# Altium schematic sheet Power Selection - AUX.SchDoc: Title
size B; Organization: Midnight Sun Solar Rayce Car Team; Address1: University of Waterloo; Address2: 200 University Ave W; Address3: Waterloo, ON, Canada; Address4: N2L 3E9; Website: www.uwmidsun.com; ProjectName: ProjectName
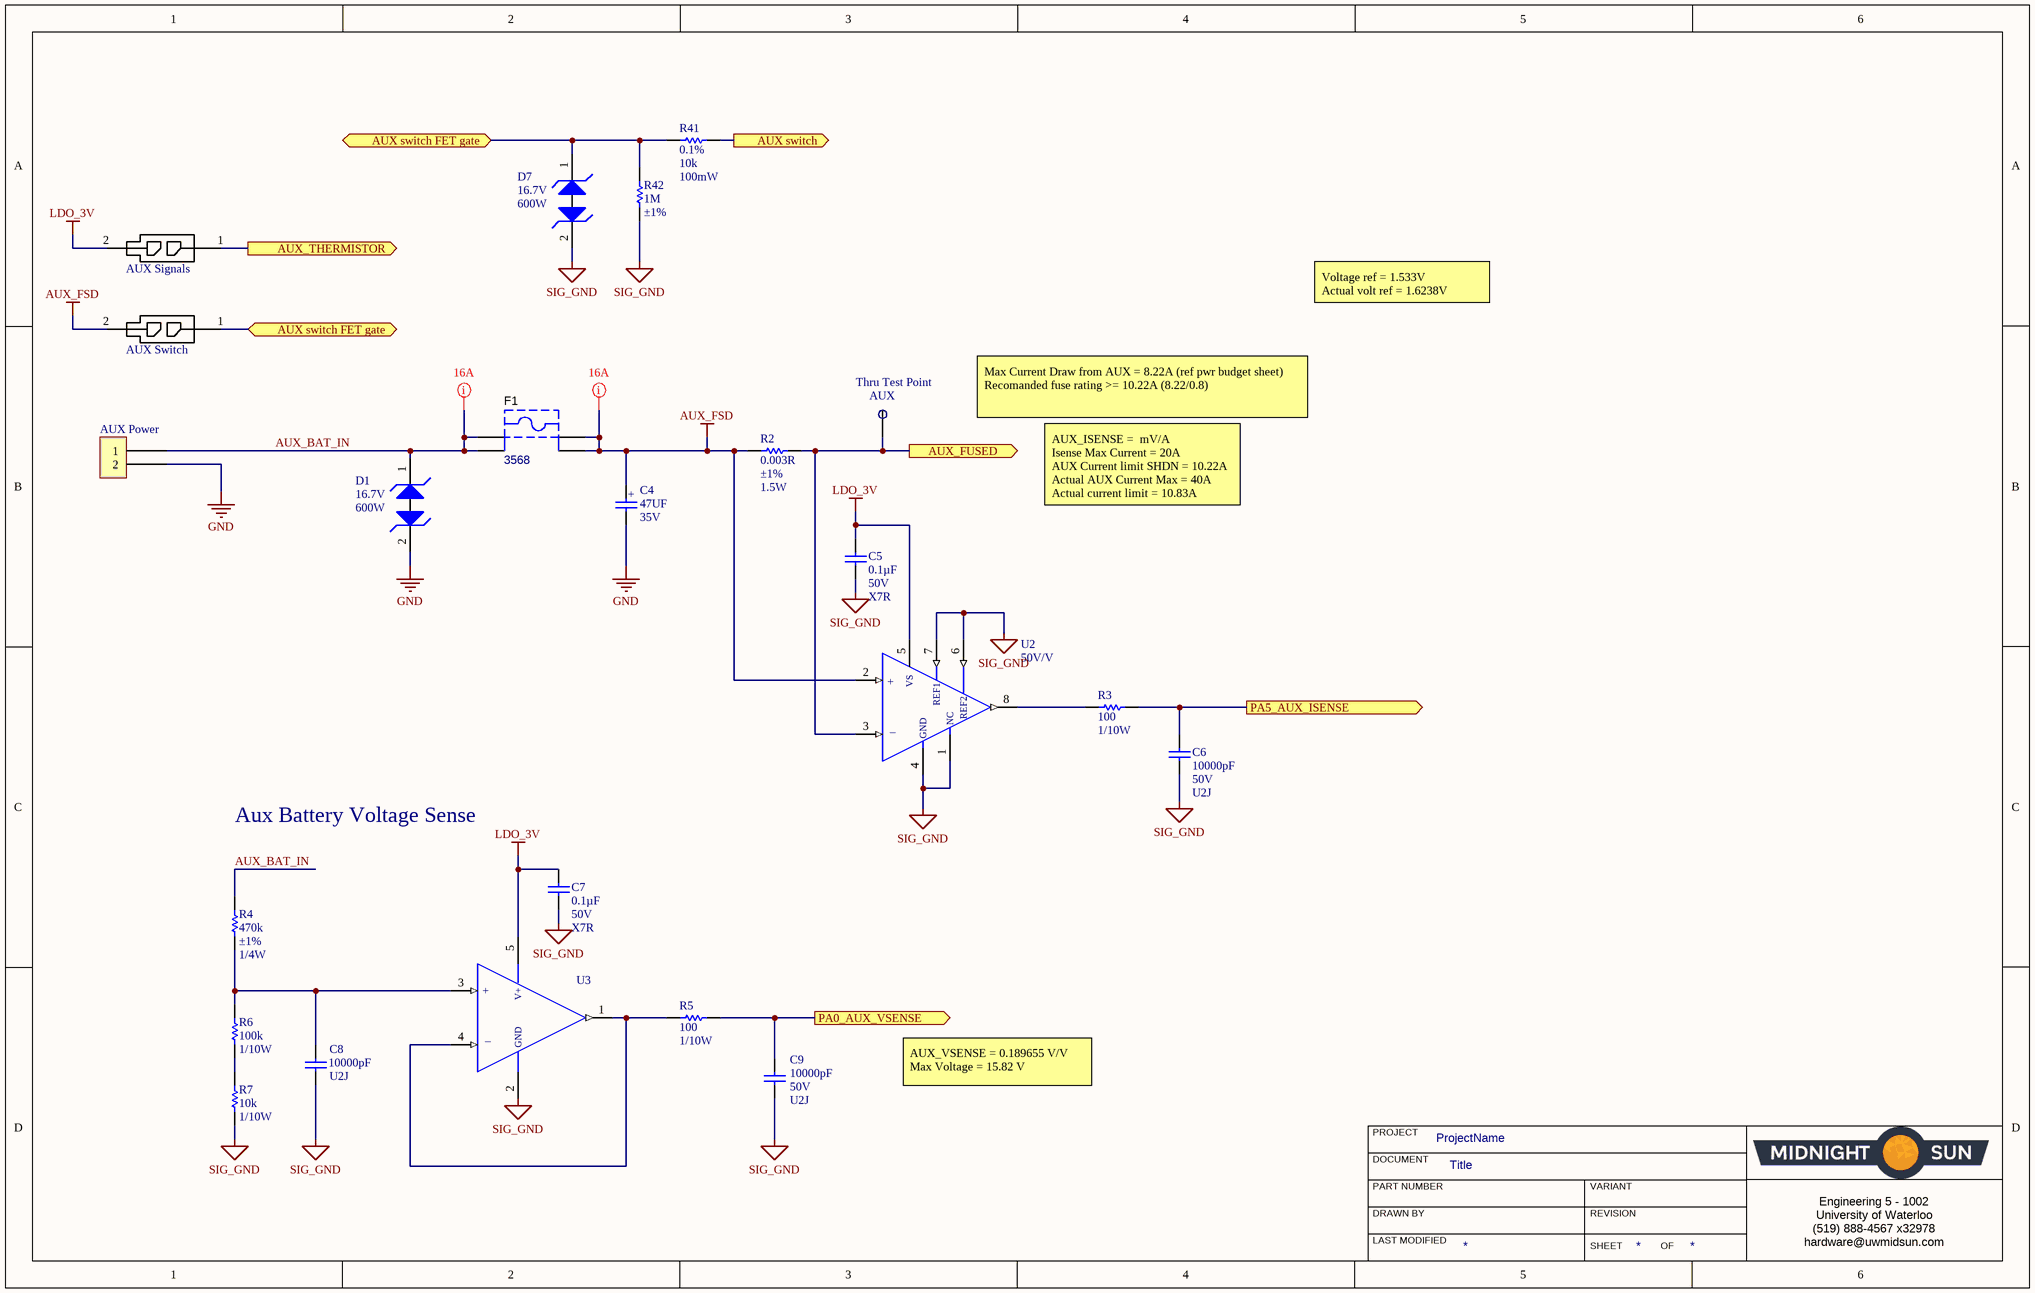
[diagram p0: Power Selection - AUX.SchDoc]

## Parts
AUX  Thru Test Point  [Thru Test Point]
AUX_Power  CONN HEADER TE  ELCON Mini 2POS PCB  [CONN HEADER TE  ELCON Mini 2POS PCB-Footprint-1]  (value not drawn)
AUX_Signals  CONN 2POS MICRO-FIT 3mm  [CONN, 2POS MICRO-FIT]  (value not drawn)
AUX_Switch  CONN 2POS MICRO-FIT 3mm  [CONN, 2POS MICRO-FIT]  (value not drawn)
C4  47UF  Voltage Rating: 35V  [CAP ALUM 6.3MM RADIAL SMD]
C5  Capacitance: 0.1µF  Voltage: 50V  Temperature Coefficient: X7R  [CAP, 0603]  (hidden comment: CAP CER 0.1UF 50V 10% X7R 0603)
C6  Capacitance: 10000pF  Voltage: 50V  Temperature Coefficient: U2J  [CAP, 0603]  (hidden comment: CAP CER 10nF 50V 5% X7R 0603)
C7  Capacitance: 0.1µF  Voltage: 50V  Temperature Coefficient: X7R  [CAP, 0603]  (hidden comment: CAP CER 0.1UF 50V 10% X7R 0603)
C8  Capacitance: 10000pF  Temperature Coefficient: U2J  [CAP, 0603]  (hidden comment: CAP CER 10nF 50V 5% X7R 0603)
C9  Capacitance: 10000pF  Voltage: 50V  Temperature Coefficient: U2J  [CAP, 0603]  (hidden comment: CAP CER 10nF 50V 5% X7R 0603)
D1  Voltage - Breakdown (Min): 16.7V  Power - Peak Pulse: 600W  [DO-214AA Diode]  (hidden comment: DIODE TVS 15VWM 24.4VC DO-214AA (SMB))
D7  Voltage - Breakdown (Min): 16.7V  Power - Peak Pulse: 600W  [DO-214AA Diode]  (hidden comment: DIODE TVS 15VWM 24.4VC DO-214AA (SMB))
F1  3568  [KSTN-3568_V]
R2  Resistance (Ohms): 0.003R  Tolerance: ±1%  Power (Watts): 1.5W  [RES 2010]  (hidden comment: RES 0.003 OHM 1% 1.5W 2010)
R3  Resistance: 100  Power: 1/10W  [RES, 0603]  (hidden comment: RES 100 OHM 1% 1/10W 0603)
R4  Resistance: 470k  Tolerance: ±1%  Power: 1/4W  [RES, 0603]  (hidden comment: RES 470K OHM 1% 1/4W 0603)
R5  Resistance: 100  Power: 1/10W  [RES, 0603]  (hidden comment: RES 100 OHM 1% 1/10W 0603)
R6  Resistance: 100k  Power: 1/10W  [RES, 0603]  (hidden comment: RES 100K OHM 5% 1/8W 0603)
R7  Resistance: 10k  Power: 1/10W  [RES, 0603]  (hidden comment: RES 10K OHM 1% 1/10W 0603)
R41  value 10k  Tolerance: 0.1%  Max Power Dissipation: 100mW  [RES, 0603]  (hidden comment: RES SMD 1K OHM 0.1% 1/10W 0603)
R42  Resistance (Ohms): 1M  Tolerance: ±1%  [RES, 0603]  (hidden comment: RES 1M OHM 1% 1/10W 0603)
U2  50V/V  [IC CURRENT AMPLIFIER INA240 TSSOP-8]
U3  IC OP AMP GEN PURPOSE RR 10MHZ SOT-23-5  [IC OP AMP GP RR 10MHZ SOT-23-5]  (value not drawn)

## Ports
AUX switch (out), AUX switch FET gate (bidir), AUX_FUSED (out), AUX_THERMISTOR (out), PA0_AUX_VSENSE (out), PA5_AUX_ISENSE (out)

## Nets
AUX_FSD: AUX_Switch.2 C4.1 F1.3 F1.4 R2.1 U2.2(+IN)
GND: AUX_Power.2 C4.2 D1.2(Cathode2)
LDO_3V: AUX_Signals.2 C5.1 C7.1 U2.5(VS) U3.5(VDD)
SIG_GND: C5.2 C6.2 C7.2 C8.2 C9.2 D7.2(Cathode2) R7.2 R42.2 U2.1(NC) U2.4(GND) U2.6(REF2) U2.7(REF1) U3.2(VSS)
AUX switch: R41.2 ; port AUX switch
AUX switch FET gate: AUX_Switch.1 D7.1(Cathode1) R41.1 R42.1 ; port AUX switch FET gate
AUX_BAT_IN: AUX_Power.1 D1.1(Cathode1) F1.1 F1.2 R4.1
AUX_FUSED: AUX.TH_TP R2.2 U2.3(-IN) ; port AUX_FUSED
AUX_THERMISTOR: AUX_Signals.1 ; port AUX_THERMISTOR
PA0_AUX_VSENSE: C9.1 R5.2 ; port PA0_AUX_VSENSE
PA5_AUX_ISENSE: C6.1 R3.2 ; port PA5_AUX_ISENSE
NetC8_1: C8.1 R4.2 R6.1 U3.3(+IN)
NetR3_1: R3.1 U2.8(OUTPUT)
NetR5_1: R5.1 U3.1(OUTPUT) U3.4(-IN)
NetR6_2: R6.2 R7.1

## Layout directives
net class HighCurrent; rule Power Plane Connect Style [Style - Direct Connect]; rule Polygon Connect Style [Style - Direct Connect]: AUX_BAT_IN, AUX_FSD

## Notes on the sheet
- Voltage ref = 1.533V
  Actual volt ref = 1.6238V
- Max Current Draw from AUX = 8.22A (ref pwr budget sheet)
  Recomanded fuse rating >= 10.22A (8.22/0.8)
- AUX_ISENSE =  mV/A
  Isense Max Current = 20A
  AUX Current limit SHDN = 10.22A
  Actual AUX Current Max = 40A
  Actual current limit = 10.83A
- Aux Battery Voltage Sense
- AUX_VSENSE = 0.189655 V/V
  Max Voltage = 15.82 V
- PROJECT
- DOCUMENT
- DRAWN BY
- LAST MODIFIED
- PART NUMBER
- REVISION
- SHEET
- VARIANT
- OF
- Engineering 5 - 1002
  University of Waterloo
  (519) 888-4567 x32978
  hardware@uwmidsun.com
- (in symbol CAP ALUM 47UF 20% 35V SMD) +
- (in symbol IC CURRENT AMPLIFIER INA240 8-TSSOP) +; _
- (in symbol IC OP AMP GEN PURPOSE RR 10MHZ SOT-23-5) V+; +; GND; _

## Library data of the parts
AUX_Power = CMP-002-00071-4: CONN HEADER 2POS PCB; Contact Current Rating: 40A; Number of Contacts: 2; Pitch: 7.8mm; Contact Retention: Yes (With); Sealable: No (Without); Current Rating: 45A; Circuit Application: Power; Gender: Male; Connector Type: Pin; PCB Mounting Orientation: Vertical; Number of Ports: 1; Connector System: Wire-to-Board; Number of Rows: 1; Contact Plating: Silver; Housing Color: Black; Length: 18.9mm; Package Quantity: 150; Number of Terminals: 4; Orientation: Straight; REACH SVHC: Unknown; Contact Material: Copper Alloy,Copper; Housing Material: Polymer; Depth: 10.2mm; Row Spacing: 7.8mm; Termination: Through Hole; Min Operating Temperature: -40°C; Number of Positions: 2; Contact Gender: Male; Packaging: Tape and Reel; Mount: Through Hole; Number of Power Positions: 2; Radiation Hardening: No; Flammability Rating: UL94 V-0; Max Operating Temperature: 125°C
AUX_Signals AUX_Switch = CONN 2POS MICRO-FIT 3mm: Connector Header Through Hole 2 position; Manufacturer: Molex; Manufacturer Part Number: 43045-0227; Number of Positions: 2; Gender: Male; Contact Resistance: 10mR; Number of Ports: 1; Max Voltage Rating (DC): 250.25kV; Current Rating: 5A; Voltage Rating: 600V; Glow Wire Compliant: Compliant; Supplier 1: Digi-Key; Stock 1: 3657; Pricing 1: 1=0.84, 10=0.74, 25=0.6968, 50=0.6676, 100=0.6387, 250=0.5806, 500=0.52254, 1000=0.46448, 2500=0.42094 (USD); Mount: Through Hole; Contact Plating: Tin; Contact Material: Brass; Housing Colour: Black; Housing Material: Thermoplastic; Number of Terminals: 2; Min Operating Temperature: -40°C; Max Operating Temperature: 105°C; Number of Rows: 2; Packaging: Tray; Termination: Solder; Number of Contacts: 2; Orientation: Vertical; Package Quantity: 3168; Number of Circuits: 2; Length: 7.15mm; Pitch: 3mm; Depth: 8.77mm; Row Spacing: 3mm; Radiation Hardening: No; Halogen Free: Low Halogen; ComponentLink1URL: http://www.onlinecomponents.com/productFiles/mf-MOL/307170430450227_pcb_headers.pdf; ComponentLink1Description: http://www.onlinecomponents.com/productFiles/mf-MOL/307170430450227_pcb_headers.pdf; ComponentLink2URL: http://www.mouser.com/ds/2/276/0430450227_PCB_HEADERS-142611.pdf; ComponentLink2Description: http://www.mouser.com/ds/2/276/0430450227_PCB_HEADERS-142611.pdf; ComponentLink3URL: http://uk.rs-online.com/webdocs/13c3/0900766b813c3a46.pdf; ComponentLink3Description: http://uk.rs-online.com/webdocs/13c3/0900766b813c3a46.pdf; ComponentLink4URL: http://www.molex.com/webdocs/datasheets/pdf/en-us/0430450227_PCB_HEADERS.pdf; ComponentLink4Description: http://www.molex.com/webdocs/datasheets/pdf/en-us/0430450227_PCB_HEADERS.pdf; Supplier Part Number 1: WM10657-ND
C4 = CAP ALUM 47UF 20% 35V SMD: 47µF 35V Aluminum Electrolytic Capacitors Radial, Can - SMD 1000 Hrs @ 85°C; Manufacturer: Panasonic; Manufacturer Part Number: EEE-1VA470WP; Tolerance: 20%; Ripple Current: 70mA; Life (Hours): 1000Hour; Supplier 1: Digi-Key; Stock 1: 2820; Pricing 1: 1=0.38, 10=0.263, 100=0.1579, 500=0.11846 (USD); Mount: Surface Mount,PCB; Case/Package: Radial; Contact Plating: Tin; Min Operating Temperature: -40°C; Max Operating Temperature: 85°C; Capacitance: 47uF; Voltage Rating (DC): 35V; Packaging: Tape and Reel; Package Quantity: 1; Ripple Current (AC): 70mA; Termination: SMD/SMT; Diameter: 6.3mm; Length: 5.5mm; Height: 5.4mm; Height - Seated (Max): 0.213inch; Radiation Hardening: No; REACH SVHC: Unknown; Lead Free: Lead Free; ComponentLink1URL: https://datasheet.ciiva.com/2983/aba0000ce2-2983926.pdf; ComponentLink1Description: https://datasheet.ciiva.com/2983/aba0000ce2-2983926.pdf; ComponentLink2URL: https://datasheet.ciiva.com/2983/aba0000ce2-2983927.pdf; ComponentLink2Description: https://datasheet.ciiva.com/2983/aba0000ce2-2983927.pdf; ComponentLink3URL: https://datasheet.ciiva.com/14598/70255710-14598937.pdf; ComponentLink3Description: https://datasheet.ciiva.com/14598/70255710-14598937.pdf; ComponentLink4URL: https://datasheet.ciiva.com/15165/getdatasheetpartid-86239-15165868.pdf; ComponentLink4Description: https://datasheet.ciiva.com/15165/getdatasheetpartid-86239-15165868.pdf; ComponentLink5URL: https://datasheet.ciiva.com/16507/aba0000ce2-16507965.pdf; ComponentLink5Description: https://datasheet.ciiva.com/16507/aba0000ce2-16507965.pdf; ComponentLink6URL: https://datasheet.ciiva.com/30206/11aba0000ce2-30206253.pdf; ComponentLink6Description: https://datasheet.ciiva.com/30206/11aba0000ce2-30206253.pdf; Supplier Part Number 1: PCE3961CT-ND
C5 C7 = CAP CER 0.1UF 50V 10% X7R 0603: 0.10µF ±10% 50V Ceramic Capacitor X7R 0603 (1608 Metric); Manufacturer 1: AVX Corporation; Manufacturer Part Number 1: 06035C104KAT2A; Supplier 1: Digi-Key; Supplier Part Number 1: 478-5052-1-ND; Packaging: Cut Tape (CT); Part Status: Active; Operating Temperature: -55°C ~ 125°C; Ratings: -; Mounting Type: Surface Mount, MLCC; Package / Case: 0603 (1608 Metric); Size / Dimension: 0.063" L x 0.032" W (1.60mm x 0.81mm); Height - Seated (Max): -; Thickness (Max): 0.035" (0.90mm); Lead Spacing: -; Lead Style: -; ComponentLink1URL: http://datasheets.avx.com/X7RDielectric.pdf; ComponentLink1Description: http://datasheets.avx.com/X7RDielectric.pdf; Tolerance: ±10%
C6 C8 C9 = CAP CER 10nF 50V 5% X7R 0603: 10000pF ±5% 50V Ceramic Capacitor U2J 0603 (1608 Metric); Manufacturer 1: KEMET; Manufacturer Part Number 1: C0603C103J5JAC7867; Supplier 1: Digi-Key; Supplier Part Number 1: 399-13384-1-ND; Packaging: Cut Tape (CT); Part Status: Active; Operating Temperature: -55°C ~ 125°C; Ratings: -; Failure Rate: -; Mounting Type: Surface Mount, MLCC; Package / Case: 0603 (1608 Metric); Size / Dimension: 0.063" L x 0.032" W (1.60mm x 0.80mm); Height - Seated (Max): -; Thickness (Max): 0.034" (0.87mm); Lead Spacing: -; Lead Style: -; ComponentLink1URL: http://www.kemet.com/docfinder?Partnumber=C0603C103J5JAC7867; ComponentLink1Description: http://www.kemet.com/docfinder?Partnumber=C0603C103J5JAC7867; Tolerance: ±5%
  C8: Voltage: 50V
D1 D7 = DIODE TVS 15VWM 24.4VC DO-214AA (SMB): TVS DIODE 15VWM 24.4VC SMB; Manufacturer 1: Fairchild/ON Semiconductor; Manufacturer Part Number 1: SMBJ15CA; Type: Zener; Voltage - Reverse Standoff (Typ): 15V; Voltage - Clamping (Max) @ Ipp: 24.4V; Current - Peak Pulse (10/1000µs): 24.6A; Power Line Protection: No; Supplier 1: Digi-Key; Supplier Part Number 1: SMBJ15CAFSCT-ND; RoHS: RoHS Compliant; Description 1: TVS DIODE 15VWM 24.4VC SMB; Category: Circuit Protection; Stock 1: 24965; Pricing 1: 1=0.54, 10=0.444, 100=0.3027, 500=0.22704, 1000=0.17028 (CAD); Packaging: Cut Tape (CT); Part Status: Active; Applications: General Purpose; Capacitance @ Frequency: -; Operating Temperature: -55°C ~ 150°C (TJ); Mounting Type: Surface Mount; Package / Case: DO-214AA, SMB; Supplier Device Package: DO-214AA (SMB); ComponentLink1URL: https://www.fairchildsemi.com/datasheets/SM/SMBJ10CA.pdf; ComponentLink1Description: https://www.fairchildsemi.com/datasheets/SM/SMBJ10CA.pdf
F1 = CMP-005-00014-1: Fuse Holder 20A 500VAC Pin Through Hole; Illumination Type: Illuminated; Number of Poles: 1; Voltage: 500V; Color: Black; Approvals: UL; Fuse Type: Automotive; Body Material: Nylon; Material: Brass,Tin,Nylon; Fuse Current: 20A; REACH SVHC: No SVHC; Depth: 6.73mm; Current Rating: 20A; Length: 16mm; Flammability Rating: UL94 V-0; Mount: PCB,Vertical; Voltage Rating (AC): 500V; Contact Plating: Tin; Max Operating Temperature: 145°C; Min Operating Temperature: -50°C; Lead Free: Lead Free; Package Quantity: 1; Number of Circuits: 1; Termination: PC Pin; Orientation: Vertical; Contact Material: Brass,Tin
R2 = RES 0.003 OHM 1% 1.5W 2010: 0.003 Ohm ±1% 1.5W Chip Resistor 2010 (5025 Metric) Current Sense, Moisture Resistant Metal Foil; Manufacturer 1: Stackpole Electronics Inc.; Manufacturer Part Number 1: CSNL2010FT3L00; Description 1: RES SMD 0.003 OHM 1% 1.5W 2010; Temperature Coefficient: ±50ppm/°C; Supplier 1: Digi-Key; Supplier Part Number 1: CSNL2010FT3L00CT-ND; RoHS: RoHS Compliant; Category: Resistors; Stock 1: 18532; Pricing 1: 1=1.02, 10=0.844, 25=0.7232, 50=0.6508, 100=0.5665, 250=0.5062, 500=0.4098, 1000=0.33145 (CAD); Packaging: Cut Tape (CT); Part Status: Active; Composition: Metal Foil; Features: Current Sense, Moisture Resistant; Operating Temperature: -55°C ~ 170°C; Package / Case: 2010 (5025 Metric); Supplier Device Package: 2010; Size / Dimension: 0.200" L x 0.100" W (5.08mm x 2.54mm); Height - Seated (Max): 0.041" (1.04mm); Failure Rate: -; ComponentLink1URL: https://www.seielect.com/Catalog/SEI-csnl.pdf; ComponentLink1Description: https://www.seielect.com/Catalog/SEI-csnl.pdf
R3 R5 = RES 100 OHM 1% 1/10W 0603: 100 Ohm ±1% 0.1W, 1/10W Chip Resistor 0603 (1608 Metric) Moisture Resistant Thick Film; Manufacturer 1: Yageo; Manufacturer Part Number 1: RC0603FR-07100RL; Temperature Coefficient: ±100ppm/°C; Supplier 1: Digi-Key; Supplier Part Number 1: 311-100HRCT-ND; Packaging: Cut Tape (CT); Part Status: Active; Composition: Thick Film; Operating Temperature: -55°C ~ 155°C; Package / Case: 0603 (1608 Metric); Supplier Device Package: 0603; Size / Dimension: 0.063" L x 0.031" W (1.60mm x 0.80mm); Height - Seated (Max): 0.022" (0.55mm); Failure Rate: -; ComponentLink1URL: http://www.yageo.com/documents/recent/PYu-RC_Group_51_RoHS_L_7.pdf; ComponentLink1Description: http://www.yageo.com/documents/recent/PYu-RC_Group_51_RoHS_L_7.pdf; Tolerance: ±1%
R4 = RES 470K OHM 1% 1/4W 0603: RES SMD 470K OHM 1% 1/4W 0603; Manufacturer 1: Panasonic Electronic Components; Manufacturer Part Number 1: ERJ-PA3F4703V; Temperature Coefficient: ±100ppm/°C; Supplier 1: Digi-Key; Supplier Part Number 1: P470KBYCT-ND; Packaging: Cut Tape (CT); Part Status: Active; Composition: Thick Film; Operating Temperature: -55°C ~ 155°C; Package / Case: 0603 (1608 Metric); Supplier Device Package: 0603; Size / Dimension: 0.063" L x 0.031" W (1.60mm x 0.80mm); Height - Seated (Max): 0.022" (0.55mm); Failure Rate: -; ComponentLink1URL: https://industrial.panasonic.com/cdbs/www-data/pdf/RDO0000/AOA0000C291.pdf; ComponentLink1Description: https://industrial.panasonic.com/cdbs/www-data/pdf/RDO0000/AOA0000C291.pdf
R6 = RES 100K OHM 5% 1/8W 0603: RES SMD 100K OHM 5% 1/10W 0603; Manufacturer 1: Yageo; Manufacturer Part Number 1: RC0603JR-07100KL; Temperature Coefficient: ±100ppm/°C; Supplier 1: Digi-Key; Supplier Part Number 1: 311-100KGRCT-ND; Packaging: Cut Tape (CT); Part Status: Active; Composition: Thick Film; Operating Temperature: -55°C ~ 155°C; Package / Case: 0603 (1608 Metric); Supplier Device Package: 0603; Size / Dimension: 0.063" L x 0.031" W (1.60mm x 0.80mm); Height - Seated (Max): 0.022" (0.55mm); Failure Rate: -; ComponentLink1URL: http://www.yageo.com/documents/recent/PYu-RC_Group_51_RoHS_L_7.pdf; ComponentLink1Description: http://www.yageo.com/documents/recent/PYu-RC_Group_51_RoHS_L_7.pdf; Tolerance: ±5%
R7 = RES 10K OHM 1% 1/10W 0603: RES SMD 10K OHM 1% 1/10W 0603; Manufacturer 1: Yageo; Manufacturer Part Number 1: RC0603FR-0710KL; Temperature Coefficient: ±100ppm/°C; Supplier 1: Digi-Key; Supplier Part Number 1: 311-10.0KHRCT-ND; Packaging: Cut Tape (CT); Part Status: Active; Composition: Thick Film; Operating Temperature: -55°C ~ 155°C; Package / Case: 0603 (1608 Metric); Supplier Device Package: 0603; Size / Dimension: 0.063" L x 0.031" W (1.60mm x 0.80mm); Height - Seated (Max): 0.022" (0.55mm); Failure Rate: -; ComponentLink1URL: http://www.yageo.com/documents/recent/PYu-RC_Group_51_RoHS_L_7.pdf; ComponentLink1Description: http://www.yageo.com/documents/recent/PYu-RC_Group_51_RoHS_L_7.pdf; Tolerance: ±1%
R41 = CMP-010-0039-1: 1 kOhms ��0.1% 0.1W, 1/10W Chip Resistor 0603 (1608 Metric) Automotive AEC-Q200 Thin Film; Manufacturer: Panasonic; Manufacturer Part Number: ERA3AEB103V; Voltage Rating: 75V; Temperature Coefficient: 25ppm/��C; Power Rating: 100mW; Number of Terminations: 2; Mount: Surface Mount; Packaging: Tape and Reel; RoHS: Yes; Termination: SMD/SMT; ComponentLink7Description: http://www.farnell.com/datasheets/2059650.pdf; Military Standard: Not; Stock 1: 2747820; ComponentLink6URL: http://uk.rs-online.com/webdocs/148c/0900766b8148c4ab.pdf; Lead Free: Lead Free; Pins: 2; ComponentLink4Description: http://www.farnell.com/datasheets/2052875.pdf; Source: Schematic Diagrams.SchLib; Case Code (Metric): 1608; ComponentLink3URL: http://industrial.panasonic.com/www-data/pdf/AOA0000/AOA0000CE26.pdf; ComponentLink8URL: http://www.produktinfo.conrad.com/datenblaetter/450000-474999/451250-da-01-en-WIDERSTAND_0603_ERA.pdf; Depth: 0.8mm; Max Operating Temperature: 155��C; Case/Package: 0603; ComponentLink2Description: http://www.farnell.com/datasheets/485442.pdf; Package Quantity: 5000; Contact Plating: Tin; Width: 0.8mm; ComponentLink7URL: http://www.farnell.com/datasheets/2059650.pdf; Design Item ID: RES SMD 1K OHM 0.1% 1/10W 0603; ComponentLink4URL: http://www.farnell.com/datasheets/2052875.pdf; Radiation Hardening: No; Pricing 1: 1 = 0.35000, 10 = 0.30000, 100 = 0.11720, 1000 = 0.04906, 2500 = 0.04498 (USD); ComponentLink5URL: http://www.farnell.com/datasheets/1776116.pdf; Height: 0.45mm; ComponentLink2URL: http://www.farnell.com/datasheets/485442.pdf; ComponentLink3Description: http://industrial.panasonic.com/www-data/pdf/AOA0000/AOA0000CE26.pdf; ComponentLink1Description: Digikey; ComponentLink8Description: http://www.produktinfo.conrad.com/datenblaetter/450000-474999/451250-da-01-en-WIDERSTAND_0603_ERA.pdf; Voltage Rating (DC): 75V; ComponentLink5Description: http://www.farnell.com/datasheets/1776116.pdf; Composition: Metal Film,Thin Film; Min Operating Temperature: -55��C; Length: 1.6mm; REACH SVHC: No SVHC; ComponentLink6Description: http://uk.rs-online.com/webdocs/148c/0900766b8148c4ab.pdf; ComponentLink1URL: https://www.digikey.ca/product-detail/en/panasonic-electronic-components/ERA-3AEB102V/P1.0KDBCT-ND/1466052
R42 = RES 1M OHM 1% 1/10W 0603: 1M Ohm ±1% 0.1W, 1/10W Chip Resistor 0603 (1608 Metric) Moisture Resistant Thick Film; Manufacturer 1: Yageo; Manufacturer Part Number 1: RC0603FR-071ML; Description 1: RES SMD 1M OHM 1% 1/10W 0603; Temperature Coefficient: ±100ppm/°C; Supplier 1: Digi-Key; Supplier Part Number 1: 311-1.00MHRCT-ND; RoHS: RoHS Compliant; Category: Resistors; Stock 1: 2336711; Pricing 1: 1=0.16, 10=0.022, 100=0.0089, 1000=0.00402, 2500=0.00349 (CAD); Packaging: Cut Tape (CT); Part Status: Active; Composition: Thick Film; Features: Moisture Resistant; Operating Temperature: -55°C ~ 155°C; Package / Case: 0603 (1608 Metric); Supplier Device Package: 0603; Size / Dimension: 0.063" L x 0.031" W (1.60mm x 0.80mm); Height - Seated (Max): 0.022" (0.55mm); Failure Rate: -; ComponentLink1URL: http://www.yageo.com/documents/recent/PYu-RC_Group_51_RoHS_L_7.pdf; ComponentLink1Description: http://www.yageo.com/documents/recent/PYu-RC_Group_51_RoHS_L_7.pdf
U2 = IC CURRENT AMPLIFIER INA240 8-TSSOP: Current Sense Amplifier 1 Circuit 8-TSSOP; Manufacturer 1: Texas Instruments; Manufacturer Part Number 1: INA240A3PWR; Description 1: IC AMP CURRENT SENSE 8-TSSOP; Slew Rate: 2 V/µs; Current - Supply: 1.8mA; Voltage - Supply, Single/Dual (±): 2.7 V ~ 5.5 V; Supplier 1: Digi-Key; Supplier Part Number 1: 296-45090-1-ND; RoHS: RoHS Compliant; Category: Integrated Circuits (ICs); Stock 1: 1286; Pricing 1: 1=3.79, 10=3.397, 100=2.7311, 500=2.24388, 1000=1.85921 (CAD); Packaging: Cut Tape (CT); Part Status: Active; Amplifier Type: Current Sense; Output Type: -; Operating Temperature: -40°C ~ 125°C; Mounting Type: Surface Mount; Package / Case: 8-TSSOP (0.173", 4.40mm Width); Supplier Device Package: 8-TSSOP; ComponentLink1URL: http://www.ti.com/lit/ds/symlink/ina240.pdf; ComponentLink1Description: http://www.ti.com/lit/ds/symlink/ina240.pdf
U3 = IC OP AMP GEN PURPOSE RR 10MHZ SOT-23-5: General Purpose Amplifier 1 Circuit Rail-to-Rail SOT-23-5; Manufacturer 1: Texas Instruments; Manufacturer Part Number 1: TLV316QDBVRQ1; Description 1: IC OP AMP GP RR 10MHZ 5-SOT-23; Number of Circuits: 1; Slew Rate: 6 V/µs; Current - Supply: 400µA; Current - Output / Channel: 50mA; Voltage - Supply, Single/Dual (±): 1.8 V ~ 5.5 V, ±0.9 V ~ 2.75 V; Supplier 1: Digi-Key; Supplier Part Number 1: 296-45323-1-ND; RoHS: RoHS Compliant; Category: Integrated Circuits (ICs); Stock 1: 1747; Pricing 1: 1=1.33, 10=1.185, 100=0.9234, 500=0.76276, 1000=0.60218 (CAD); Packaging: Cut Tape (CT); Part Status: Active; Amplifier Type: General Purpose; Output Type: Rail-to-Rail; -3db Bandwidth: -; Operating Temperature: -40°C ~ 125°C; Mounting Type: Surface Mount; Package / Case: SC-74A, SOT-753; Supplier Device Package: SOT-23-5; ComponentLink1URL: http://www.ti.com/lit/ds/symlink/tlv316-q1.pdf; ComponentLink1Description: http://www.ti.com/lit/ds/symlink/tlv316-q1.pdf